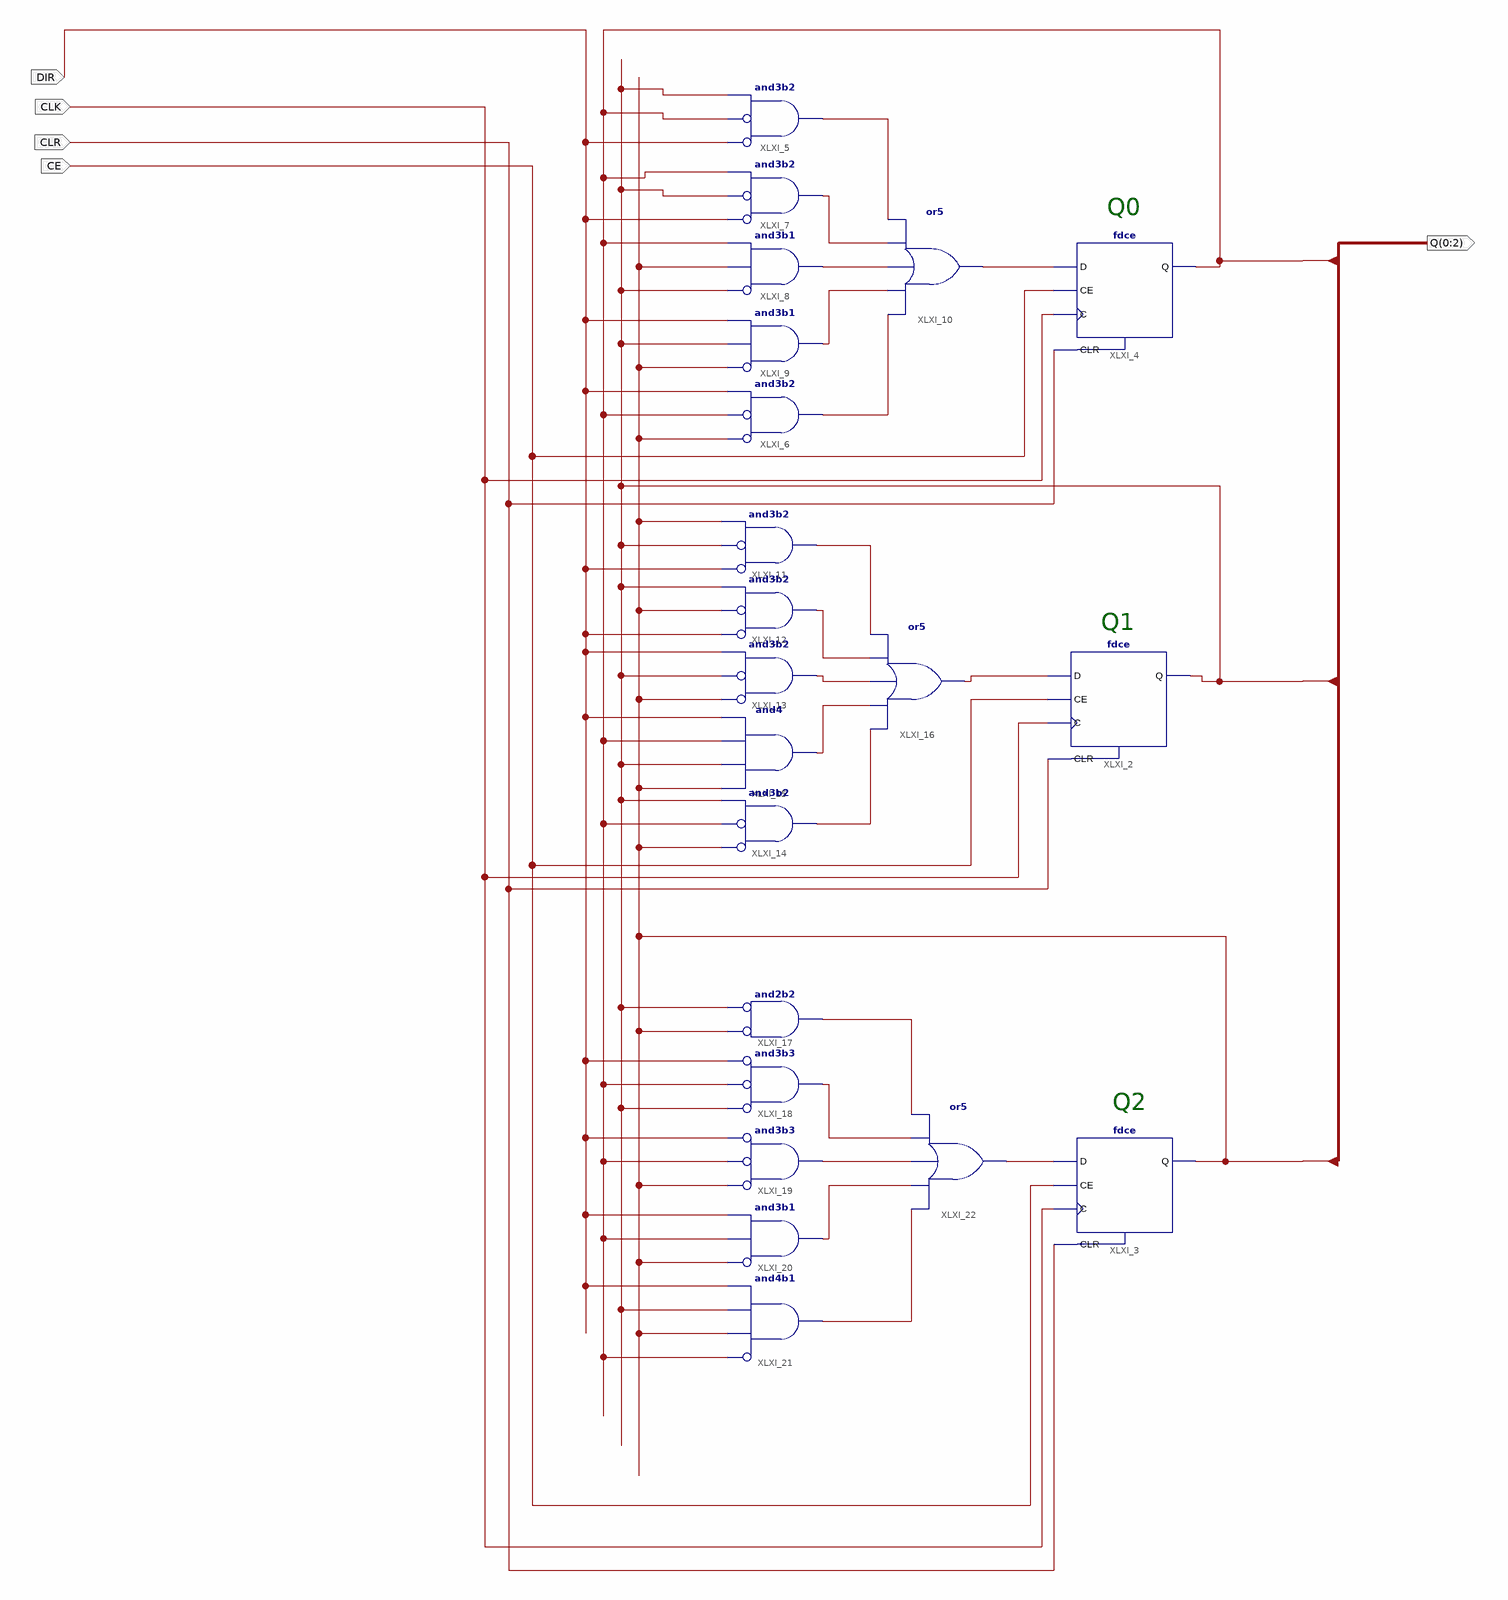
[diagram p0: schematic sheet 1]
// Xilinx ISE schematic przerzutnik.sch (xc9500xl) as structural Verilog: 21 symbols, 5 ports
module przerzutnik (
  input  CLK,
  input  DIR,
  input  CLR,
  input  CE,
  output [0:2] Q
);

  wire XLXN_28, XLXN_29, XLXN_30, XLXN_31, XLXN_32, XLXN_41, XLXN_42, XLXN_43, XLXN_44, XLXN_45, XLXN_47,
       XLXN_71, XLXN_72, XLXN_73, XLXN_74, XLXN_75, XLXN_76, XLXN_85;

  fdce XLXI_2 (.C(CLK), .CE(CE), .CLR(CLR), .D(XLXN_71), .Q(Q[1]));
  fdce XLXI_3 (.C(CLK), .CE(CE), .CLR(CLR), .D(XLXN_85), .Q(Q[2]));
  fdce XLXI_4 (.C(CLK), .CE(CE), .CLR(CLR), .D(XLXN_41), .Q(Q[0]));
  and XLXI_5 (XLXN_28, ~DIR, ~Q[0], Q[1]);  // and3b2
  and XLXI_6 (XLXN_32, ~Q[2], ~Q[0], DIR);  // and3b2
  and XLXI_7 (XLXN_29, ~DIR, ~Q[1], Q[0]);  // and3b2
  and XLXI_8 (XLXN_30, ~Q[1], Q[2], Q[0]);  // and3b1
  and XLXI_9 (XLXN_31, ~Q[2], Q[1], DIR);  // and3b1
  or XLXI_10 (XLXN_41, XLXN_32, XLXN_31, XLXN_30, XLXN_29, XLXN_28);
  and XLXI_11 (XLXN_42, ~DIR, ~Q[1], Q[2]);  // and3b2
  and XLXI_12 (XLXN_43, ~DIR, ~Q[2], Q[1]);  // and3b2
  and XLXI_13 (XLXN_44, ~Q[2], ~Q[1], DIR);  // and3b2
  and XLXI_14 (XLXN_47, ~Q[2], ~Q[0], Q[1]);  // and3b2
  and XLXI_15 (XLXN_45, Q[2], Q[1], Q[0], DIR);
  or XLXI_16 (XLXN_71, XLXN_47, XLXN_45, XLXN_44, XLXN_43, XLXN_42);
  and XLXI_17 (XLXN_72, ~Q[2], ~Q[1]);  // and2b2
  and XLXI_18 (XLXN_73, ~Q[1], ~Q[0], ~DIR);  // and3b3
  and XLXI_19 (XLXN_74, ~Q[2], ~Q[0], ~DIR);  // and3b3
  and XLXI_20 (XLXN_75, ~Q[2], Q[0], DIR);  // and3b1
  and XLXI_21 (XLXN_76, ~Q[0], Q[2], Q[1], DIR);  // and4b1
  or XLXI_22 (XLXN_85, XLXN_76, XLXN_75, XLXN_74, XLXN_73, XLXN_72);

  // Notes on the sheet:
  //   Q0
  //   Q1
  //   Q2
endmodule
